# EAGLE board pepino4 (EAGLE 6.3)
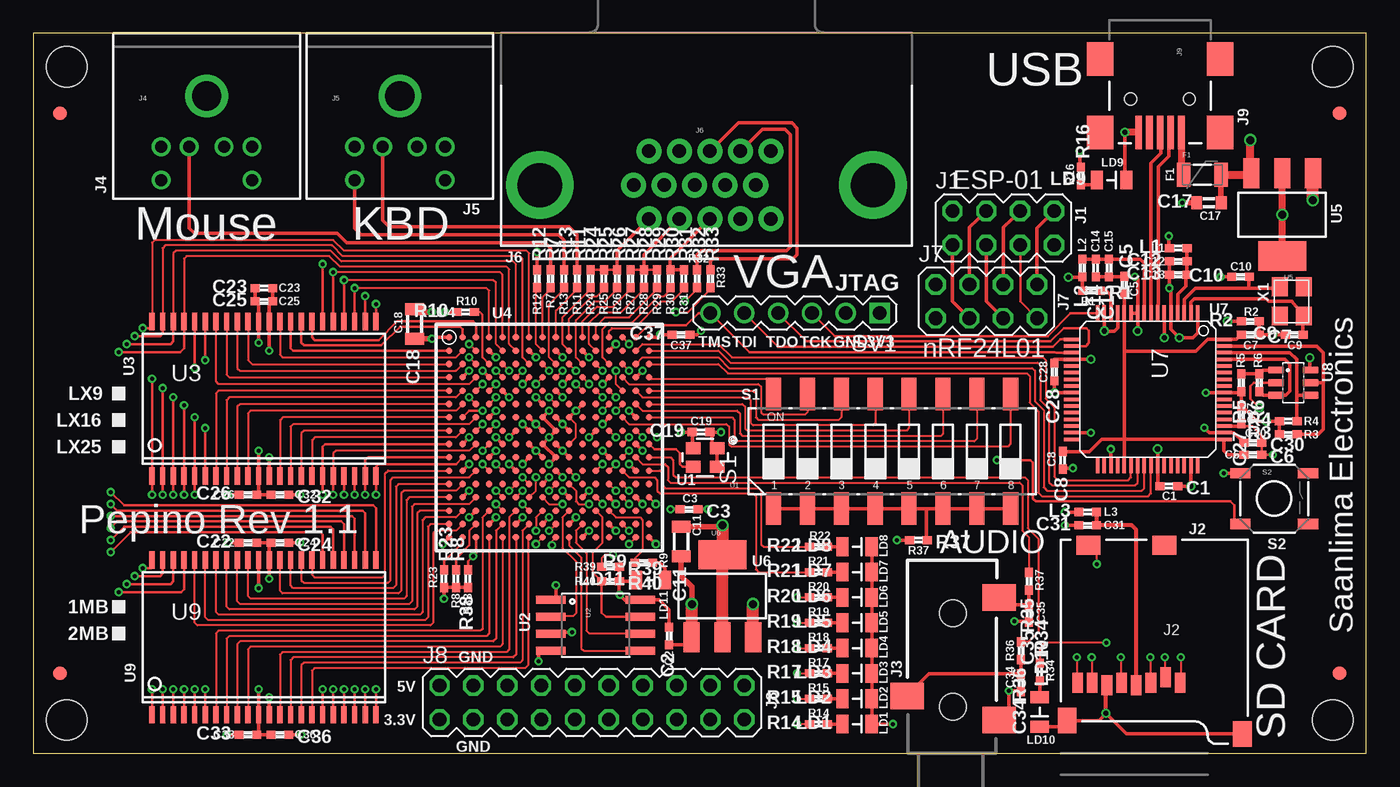
[diagram p4: board, top side]
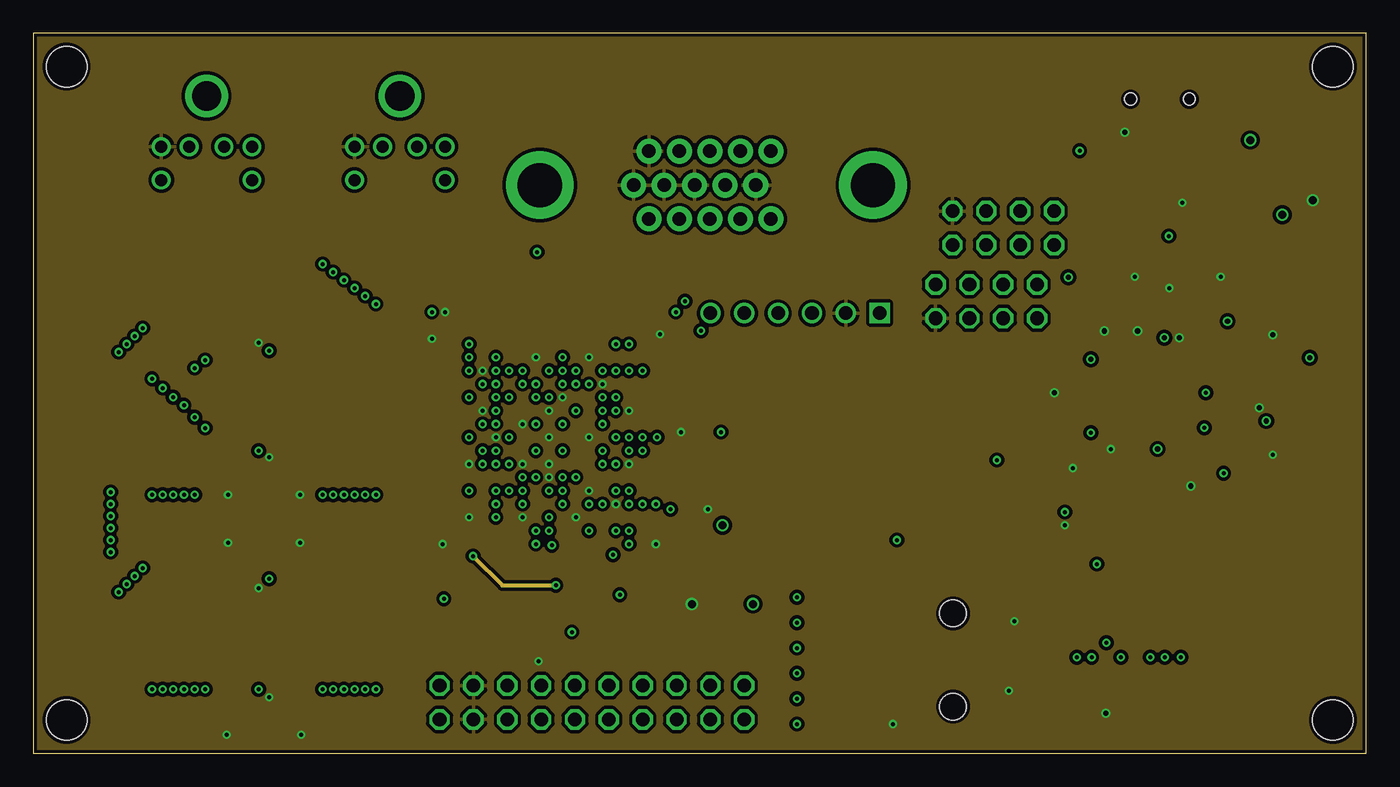
[diagram p5: board, inner layer Route2]
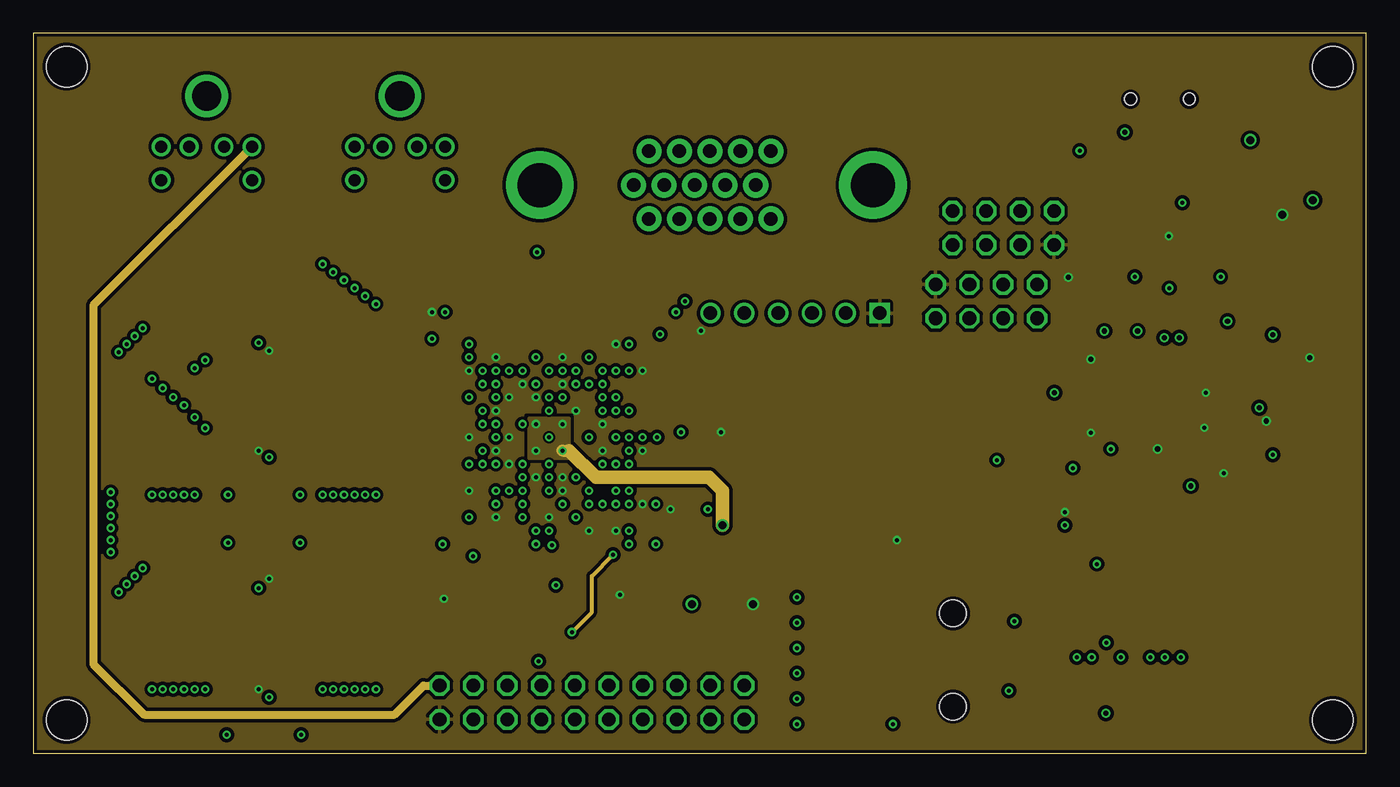
[diagram p6: board, inner layer Route3]
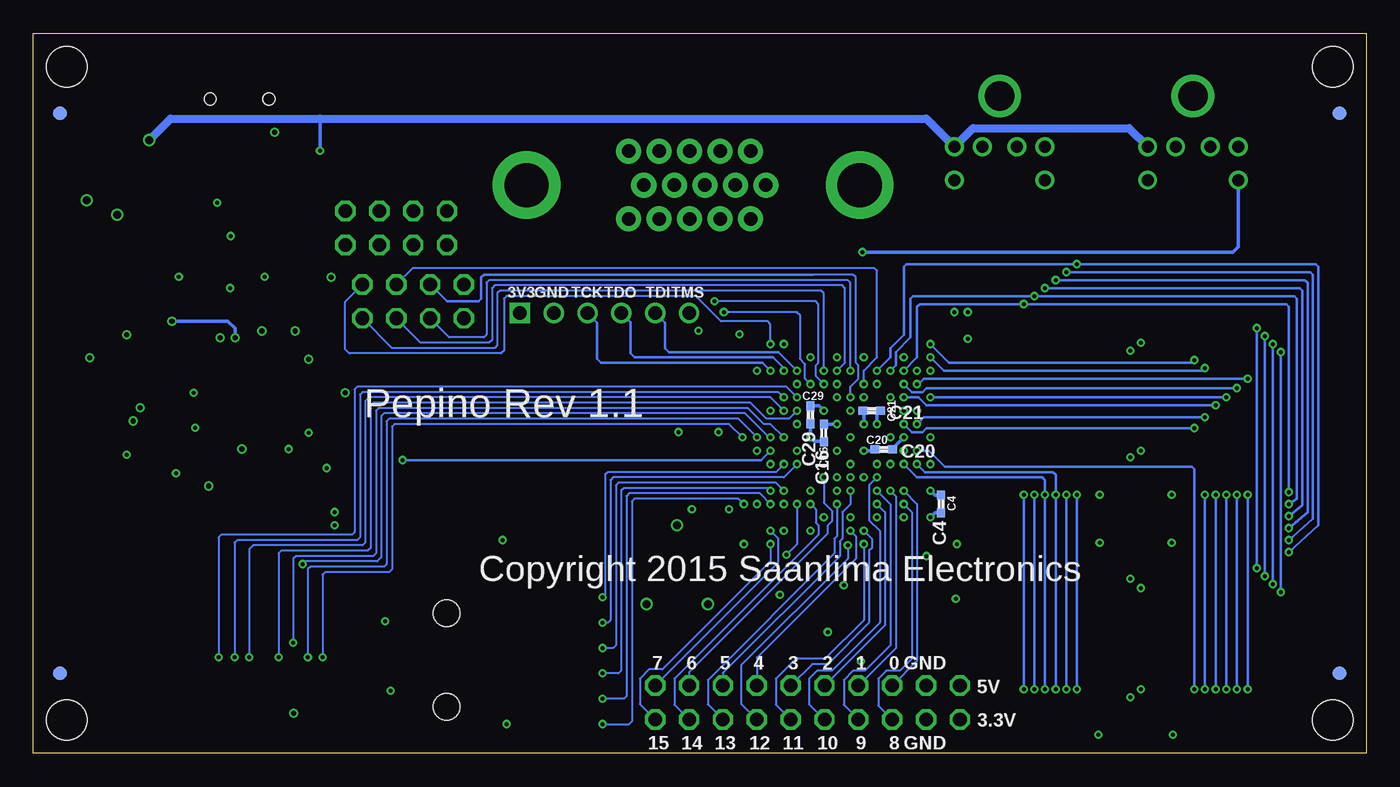
[diagram p7: board, bottom side, seen from below]

Size 100 x 54 mm. Coordinates in mm from the lower left corner, seen from the top.
Outline: 0,0 100,0 100,54 0,54 0,0
Copper layers (1*2+3*16): Top 0.035mm / dielectric 0.2mm / Route2 0.035mm / dielectric 0.05mm / Route3 0.035mm / dielectric 0.2mm / Bottom 0.035mm
Design rules "Fusion_eagle_rule_v1.1 *": minimum track width 6mil, minimum drill 0.3mm, track to track 6mil, track to pad 6mil, pad to pad 6mil, via to via 6mil, smd to smd 0mil, copper to edge 10mil, drill to drill 10mil, minimum pad ring 10mil, minimum via ring 6mil, stop-mask expansion 2mil, vias tented up to drill 12mil, thermal gap 10mil
Net classes: 1 power: width 0.203 mm
Holes 3.05 mm at 2.5,51.5 2.5,2.5 97.5,51.5 97.5,2.5

## Footprints (pad centres in the part's own frame; a part is rotated, then mirrored left to right if it is on the bottom)
0402 = smd 0.7 x 0.6: 1 -0.655,0; 2 0.655,0
0805 = smd 0.9 x 1.4: 1 -1.1,0; 2 1.1,0
0603 = smd 0.8 x 1: 1 -0.925,0; 2 0.925,0
PTC-1206 = smd 1 x 1.8: 1 -1.4,0; 2 1.4,0
MA04-2 = drill 1.016 octagon: 1 -3.81,-1.27; 2 -3.81,1.27; 3 -1.27,-1.27; 4 -1.27,1.27; 5 1.27,-1.27; 6 1.27,1.27; 7 3.81,-1.27; 8 3.81,1.27
MICRO-SD-SOCKET-PP = smd 0.8 x 1.5: 1 -8.94,10.7; 2 -7.84,10.3; 3 -6.74,10.7; 4 -5.64,10.9; 5 -4.54,10.7; 6 -3.44,10.9; 7 -2.34,10.7; 8 -1.24,10.7 | smd 1.8 x 1.4: CD1 -2.05,0.4; CD2 -7.75,0.4 | smd 1.4 x 1.9: GND1 -13.6,14.55; GND3 -0.45,13.55
AUDIO-JACK-3.5MM-3 = smd 2 x 2.5: RING 4.3,3.45; SLEEVE 2.5,-3.45; TIP 11.7,-3.45 | hole 2: 3.5,0; 10.5,0
MINI-DIN6 = drill 0.9: 1 -1.3,-8.5; 2 1.3,-8.5; 3 -3.4,-8.5; 4 3.4,-8.5; 5 -3.4,-11; 6 3.4,-11 | drill 2.2: P$1 0,-4.7
DB15 = drill 1.016 pad 1.88: 1 -4.32,-7.62; 2 -2.03,-7.62; 3 0.26,-7.62; 4 2.55,-7.62; 5 4.84,-7.62; 6 -5.46,-5.08; 7 -3.17,-5.08; 8 -0.88,-5.08; 9 1.41,-5.08; 10 3.7,-5.08; 11 -4.32,-2.54; 12 -2.03,-2.54; 13 0.26,-2.54; 14 2.55,-2.54; 15 4.84,-2.54 | drill 3.302 pad 5.08: G1 -12.5,-5.08; G2 12.5,-5.08
MA10-2 = drill 1.016 octagon: 1 -11.43,-1.27; 2 -11.43,1.27; 3 -8.89,-1.27; 4 -8.89,1.27; 5 -6.35,-1.27; 6 -6.35,1.27; 7 -3.81,-1.27; 8 -3.81,1.27; 9 -1.27,-1.27; 10 -1.27,1.27; 11 1.27,-1.27; 12 1.27,1.27; 13 3.81,-1.27; 14 3.81,1.27; 15 6.35,-1.27; 16 6.35,1.27; 17 8.89,-1.27; 18 8.89,1.27; 19 11.43,-1.27; 20 11.43,1.27
USB-MINIB = smd 2.5 x 0.5: D+ 2.5,0; D- 2.5,0.8; GND 2.5,-1.6; ID 2.5,-0.8; VBUS 2.5,1.6 | smd 2.5 x 2: MTN1 -3,4.5; MTN2 2.5,4.5; MTN3 -3,-4.5; MTN4 2.5,-4.5 | hole 0.9: 0,2.2; 0,-2.2
FIDUCIAL-1X2 = smd 1 x 1: 1 0,0
0805_POL = smd 0.9 x 1.4: + 1.1,0; - -1.1,0
CTS-219-08 = smd 1.13 x 2.44: 1 -8.89,-4.3; 2 -6.35,-4.3; 3 -3.81,-4.3; 4 -1.27,-4.3; 5 1.27,-4.3; 6 3.81,-4.3; 7 6.35,-4.3; 8 8.89,-4.3; 9 8.89,4.3; 10 6.35,4.3; 11 3.81,4.3; 12 1.27,4.3; 13 -1.27,4.3; 14 -3.81,4.3; 15 -6.35,4.3; 16 -8.89,4.3
TACTILE_SWITCH_SMD = smd 1.524 x 0.762: 1 -2.54,1.905; 2 2.54,1.905; 3 -2.54,-1.905; 4 2.54,-1.905
MA06-1 = drill 1.016 square: 1 0,0 | drill 1.016: 2 2.54,0; 3 5.08,0; 4 7.62,0; 5 10.16,0; 6 12.7,0
CRYSTAL-OSC-SMD-2.5X2 = smd 1.1 x 0.9: 1 -0.9,-0.7; 2 0.9,-0.7; 3 0.9,0.7; 4 -0.9,0.7
SO08-EIAJ = smd 0.61 x 2.21: 1 -1.905,-3.378; 2 -0.635,-3.378; 3 0.635,-3.378; 4 1.905,-3.378; 5 1.905,3.353; 6 0.635,3.353; 7 -0.635,3.353; 8 -1.905,3.353
TSOP44-II = smd 0.4 x 1.3: 1 -8.4,-5.8; 2 -7.6,-5.8; 3 -6.8,-5.8; 4 -6,-5.8; 5 -5.2,-5.8; 6 -4.4,-5.8; 7 -3.6,-5.8; 8 -2.8,-5.8; 9 -2,-5.8; 10 -1.2,-5.8; 11 -0.4,-5.8; 12 0.4,-5.8; 13 1.2,-5.8; 14 2,-5.8; 15 2.8,-5.8; 16 3.6,-5.8; 17 4.4,-5.8; 18 5.2,-5.8; 19 6,-5.8; 20 6.8,-5.8; 21 7.6,-5.8; 22 8.4,-5.8; 23 8.4,5.8; 24 7.6,5.8; 25 6.8,5.8; 26 6,5.8; 27 5.2,5.8; 28 4.4,5.8; 29 3.6,5.8; 30 2.8,5.8; 31 2,5.8; 32 1.2,5.8; 33 0.4,5.8; 34 -0.4,5.8; 35 -1.2,5.8; 36 -2,5.8; 37 -2.8,5.8; 38 -3.6,5.8; 39 -4.4,5.8; 40 -5.2,5.8; 41 -6,5.8; 42 -6.8,5.8; 43 -7.6,5.8; 44 -8.4,5.8
FT256 = smd 0.5 x 0.5: A1 -7.5,7.5; A2 -6.5,7.5; A3 -5.5,7.5; A4 -4.5,7.5; A5 -3.5,7.5; A6 -2.5,7.5; A7 -1.5,7.5; A8 -0.5,7.5; A9 0.5,7.5; A10 1.5,7.5; A11 2.5,7.5; A12 3.5,7.5; A13 4.5,7.5; A14 5.5,7.5; A15 6.5,7.5; A16 7.5,7.5; B1 -7.5,6.5; B2 -6.5,6.5; B3 -5.5,6.5; B4 -4.5,6.5; B5 -3.5,6.5; B6 -2.5,6.5; B7 -1.5,6.5; B8 -0.5,6.5; B9 0.5,6.5; B10 1.5,6.5; B11 2.5,6.5; B12 3.5,6.5; B13 4.5,6.5; B14 5.5,6.5; B15 6.5,6.5; B16 7.5,6.5; C1 -7.5,5.5; C2 -6.5,5.5; C3 -5.5,5.5; C4 -4.5,5.5; C5 -3.5,5.5; C6 -2.5,5.5; C7 -1.5,5.5; C8 -0.5,5.5; C9 0.5,5.5; C10 1.5,5.5; C11 2.5,5.5; C12 3.5,5.5; C13 4.5,5.5; C14 5.5,5.5; C15 6.5,5.5; C16 7.5,5.5; D1 -7.5,4.5; D2 -6.5,4.5; D3 -5.5,4.5; D4 -4.5,4.5; D5 -3.5,4.5; D6 -2.5,4.5; D7 -1.5,4.5; D8 -0.5,4.5; D9 0.5,4.5; D10 1.5,4.5; D11 2.5,4.5; D12 3.5,4.5; D13 4.5,4.5; D14 5.5,4.5; D15 6.5,4.5; D16 7.5,4.5; E1 -7.5,3.5; E2 -6.5,3.5; E3 -5.5,3.5; E4 -4.5,3.5; E5 -3.5,3.5; E6 -2.5,3.5; E7 -1.5,3.5; E8 -0.5,3.5; E9 0.5,3.5; E10 1.5,3.5; E11 2.5,3.5; E12 3.5,3.5; E13 4.5,3.5; E14 5.5,3.5; E15 6.5,3.5; E16 7.5,3.5; F1 -7.5,2.5; F2 -6.5,2.5; F3 -5.5,2.5; F4 -4.5,2.5; F5 -3.5,2.5; F6 -2.5,2.5; F7 -1.5,2.5; F8 -0.5,2.5; F9 0.5,2.5; F10 1.5,2.5; F11 2.5,2.5; F12 3.5,2.5; F13 4.5,2.5; F14 5.5,2.5; F15 6.5,2.5; F16 7.5,2.5; G1 -7.5,1.5; G2 -6.5,1.5; G3 -5.5,1.5; G4 -4.5,1.5; G5 -3.5,1.5; G6 -2.5,1.5; G7 -1.5,1.5; G8 -0.5,1.5; G9 0.5,1.5; G10 1.5,1.5; G11 2.5,1.5; G12 3.5,1.5; G13 4.5,1.5; G14 5.5,1.5; G15 6.5,1.5; G16 7.5,1.5; H1 -7.5,0.5; H2 -6.5,0.5; H3 -5.5,0.5; H4 -4.5,0.5; H5 -3.5,0.5; H6 -2.5,0.5; H7 -1.5,0.5; H8 -0.5,0.5; H9 0.5,0.5; H10 1.5,0.5; H11 2.5,0.5; H12 3.5,0.5; H13 4.5,0.5; H14 5.5,0.5; H15 6.5,0.5; H16 7.5,0.5; J1 -7.5,-0.5; J2 -6.5,-0.5; J3 -5.5,-0.5; J4 -4.5,-0.5; J5 -3.5,-0.5; J6 -2.5,-0.5; J7 -1.5,-0.5; J8 -0.5,-0.5; J9 0.5,-0.5; J10 1.5,-0.5; J11 2.5,-0.5; J12 3.5,-0.5; J13 4.5,-0.5; J14 5.5,-0.5; J15 6.5,-0.5; J16 7.5,-0.5; K1 -7.5,-1.5; K2 -6.5,-1.5; K3 -5.5,-1.5; K4 -4.5,-1.5; K5 -3.5,-1.5; K6 -2.5,-1.5; K7 -1.5,-1.5; K8 -0.5,-1.5; K9 0.5,-1.5; K10 1.5,-1.5; K11 2.5,-1.5; K12 3.5,-1.5; K13 4.5,-1.5; K14 5.5,-1.5; K15 6.5,-1.5; K16 7.5,-1.5; L1 -7.5,-2.5; L2 -6.5,-2.5; L3 -5.5,-2.5; L4 -4.5,-2.5; L5 -3.5,-2.5; L6 -2.5,-2.5; L7 -1.5,-2.5; L8 -0.5,-2.5; L9 0.5,-2.5; L10 1.5,-2.5; L11 2.5,-2.5; L12 3.5,-2.5; L13 4.5,-2.5; L14 5.5,-2.5; L15 6.5,-2.5; L16 7.5,-2.5; M1 -7.5,-3.5; M2 -6.5,-3.5; M3 -5.5,-3.5; M4 -4.5,-3.5; M5 -3.5,-3.5; M6 -2.5,-3.5; M7 -1.5,-3.5; M8 -0.5,-3.5; M9 0.5,-3.5; M10 1.5,-3.5; M11 2.5,-3.5; M12 3.5,-3.5; M13 4.5,-3.5; M14 5.5,-3.5; M15 6.5,-3.5; M16 7.5,-3.5; N1 -7.5,-4.5; N2 -6.5,-4.5; N3 -5.5,-4.5; N4 -4.5,-4.5; N5 -3.5,-4.5; N6 -2.5,-4.5; N7 -1.5,-4.5; N8 -0.5,-4.5; N9 0.5,-4.5; N10 1.5,-4.5; N11 2.5,-4.5; N12 3.5,-4.5; N13 4.5,-4.5; N14 5.5,-4.5; N15 6.5,-4.5; N16 7.5,-4.5; P1 -7.5,-5.5; P2 -6.5,-5.5; P3 -5.5,-5.5; P4 -4.5,-5.5; P5 -3.5,-5.5; P6 -2.5,-5.5; P7 -1.5,-5.5; P8 -0.5,-5.5; P9 0.5,-5.5; P10 1.5,-5.5; P11 2.5,-5.5; P12 3.5,-5.5; P13 4.5,-5.5; P14 5.5,-5.5; P15 6.5,-5.5; P16 7.5,-5.5; R1 -7.5,-6.5; R2 -6.5,-6.5; R3 -5.5,-6.5; R4 -4.5,-6.5; R5 -3.5,-6.5; R6 -2.5,-6.5; R7 -1.5,-6.5; R8 -0.5,-6.5; R9 0.5,-6.5; R10 1.5,-6.5; R11 2.5,-6.5; R12 3.5,-6.5; R13 4.5,-6.5; R14 5.5,-6.5; R15 6.5,-6.5; R16 7.5,-6.5; T1 -7.5,-7.5; T2 -6.5,-7.5; T3 -5.5,-7.5; T4 -4.5,-7.5; T5 -3.5,-7.5; T6 -2.5,-7.5; T7 -1.5,-7.5; T8 -0.5,-7.5; T9 0.5,-7.5; T10 1.5,-7.5; T11 2.5,-7.5; T12 3.5,-7.5; T13 4.5,-7.5; T14 5.5,-7.5; T15 6.5,-7.5; T16 7.5,-7.5
SOT223 = smd 1.219 x 2.235: 1 -2.311,-3.099; 2 0,-3.099; 3 2.311,-3.099 | smd 3.6 x 2.2: 4 0,3.099
DP-EAGLELIBRARY_LQFP64 = smd 1.2 x 0.27: 1 -5.7,3.75; 2 -5.7,3.25; 3 -5.7,2.75; 4 -5.7,2.25; 5 -5.7,1.75; 6 -5.7,1.25; 7 -5.7,0.75; 8 -5.7,0.25; 9 -5.7,-0.25; 10 -5.7,-0.75; 11 -5.7,-1.25; 12 -5.7,-1.75; 13 -5.7,-2.25; 14 -5.7,-2.75; 15 -5.7,-3.25; 16 -5.7,-3.75; 33 5.7,-3.75; 34 5.7,-3.25; 35 5.7,-2.75; 36 5.7,-2.25; 37 5.7,-1.75; 38 5.7,-1.25; 39 5.7,-0.75; 40 5.7,-0.25; 41 5.7,0.25; 42 5.7,0.75; 43 5.7,1.25; 44 5.7,1.75; 45 5.7,2.25; 46 5.7,2.75; 47 5.7,3.25; 48 5.7,3.75 | smd 0.27 x 1.2: 17 -3.75,-5.7; 18 -3.25,-5.7; 19 -2.75,-5.7; 20 -2.25,-5.7; 21 -1.75,-5.7; 22 -1.25,-5.7; 23 -0.75,-5.7; 24 -0.25,-5.7; 25 0.25,-5.7; 26 0.75,-5.7; 27 1.25,-5.7; 28 1.75,-5.7; 29 2.25,-5.7; 30 2.75,-5.7; 31 3.25,-5.7; 32 3.75,-5.7; 49 3.75,5.7; 50 3.25,5.7; 51 2.75,5.7; 52 2.25,5.7; 53 1.75,5.7; 54 1.25,5.7; 55 0.75,5.7; 56 0.25,5.7; 57 -0.25,5.7; 58 -0.75,5.7; 59 -1.25,5.7; 60 -1.75,5.7; 61 -2.25,5.7; 62 -2.75,5.7; 63 -3.25,5.7; 64 -3.75,5.7
SOT23-6 = smd 0.55 x 1.2: 1 -0.95,-1.3; 2 0,-1.3; 3 0.95,-1.3; 4 0.95,1.3; 5 0,1.3; 6 -0.95,1.3
CRYSTAL3.2X2.5MM = smd 1.4 x 1.2: 1 -1.1,-0.9; 2 1.1,-0.9; 3 1.1,0.9; 4 -1.1,0.9

## Placement (x,y rotation side)
C1  .1uF  [0402]  85.2,20.05 0 top
C2  .1uF  [0402]  47.7,8.8 270 top
C3  .1uF  [0402]  49.2,18.3 0 top
C4  4.7uF  [0402]  31.9,18.7 270 bottom
C5  4.7uF  [0402]  81.85,35.1 90 top
C6  .1uF  [0402]  91.5,22.4 0 top
C7  .1uF  [0402]  91.3,31.4 0 top
C8  .1uF  [0402]  77.22,21.98 270 top
C9  27pF  [0402]  94.6,31.4 180 top
C10  27pF  [0402]  90.58,35.75 180 top
C11  22uF  [0805]  48.6,15.9 270 top
C12  4.7uF  [0402]  85.9,36.9 180 top
C13  .1uF  [0402]  85.9,35.9 180 top
C14  4.7uF  [0402]  79.7,36.4 270 top
C15  .1uF  [0402]  80.7,36.4 270 top
C16  4.7uF  [0402]  40.7,24.02 270 bottom
C17  4.7uF  [0603]  88.2,41.3 180 top
C18  22uF  [0805]  28.6,32.2 270 top
C19  .1uF  [0402]  50.1,24.1 180 top
C20  .1uF  [0402]  36.2,22.8 0 bottom
C21  .1uF  [0402]  37.1,25.7 0 bottom
C22  4.7uF  [0402]  16.1,15.8 180 top
C23  4.7uF  [0402]  17.3,34.9 180 top
C24  .1uF  [0402]  18.5,15.8 0 top
C25  .1uF  [0402]  17.3,33.9 180 top
C26  4.7uF  [0402]  16.1,19.4 180 top
C27  .1uF  [0402]  90.62,25.4 270 top
C28  .1uF  [0402]  76.6,28.6 270 top
C29  .1uF  [0402]  41.7,25.4 270 bottom
C30  4.7uF  [0402]  91.5,23.3 0 top
C31  4.7uF  [0402]  79.1,17.1 180 top
C32  .1uF  [0402]  18.5,19.4 0 top
C33  4.7uF  [0402]  16.1,1.4 180 top
C34  4700pF  [0402]  74.1,5.3 270 top
C35  4700pF  [0402]  74.7,10.5 270 top
C36  .1uF  [0402]  18.5,1.4 0 top
C37  4.7uF  [0402]  48.6,31.4 180 top
F1  PTCSMD  [PTC-1206]  87.7,43.4 0 top
J1  ESP-01  [MA04-2]  72.77,39.4 0 top
J2  USD-SOCKETNEW  [MICRO-SD-SOCKET-PP]  77.1,16 180 top
J3  AUDIO-JACK3  [AUDIO-JACK-3.5MM-3]  69,0 90 top
J4  MINI-DIN6PTH  [MINI-DIN6]  13,54 0 top
J5  MINI-DIN6PTH  [MINI-DIN6]  27.5,54 0 top
J6  DB15  [DB15]  50.5,47.7 0 top
J7  nRF24L01+  [MA04-2]  71.5,33.9 0 top
J8  [MA10-2]  41.91,3.81 0 top
J9  USBSMD  [USB-MINIB]  84.53,49.06 270 top
JP1  FIDUCIAL1X2  [FIDUCIAL-1X2]  2,6 0 top
JP2  FIDUCIAL1X2  [FIDUCIAL-1X2]  98,48 0 top
JP3  FIDUCIAL1X2  [FIDUCIAL-1X2]  2,6 0 bottom
JP4  FIDUCIAL1X2  [FIDUCIAL-1X2]  98,48 0 bottom
JP5  FIDUCIAL1X2  [FIDUCIAL-1X2]  2,48 0 top
JP6  FIDUCIAL1X2  [FIDUCIAL-1X2]  98,6 0 top
JP7  FIDUCIAL1X2  [FIDUCIAL-1X2]  2,48 0 bottom
JP8  FIDUCIAL1X2  [FIDUCIAL-1X2]  98,6 0 bottom
L1  [0402]  85.9,37.9 180 top
L2  [0402]  78.7,36.4 270 top
L3  [0402]  79.1,18.1 180 top
LD1  [0805_POL]  61.8,2.2 180 top
LD2  [0805_POL]  61.8,4.1 180 top
LD3  [0805_POL]  61.8,6 180 top
LD4  [0805_POL]  61.8,7.9 180 top
LD5  [0805_POL]  61.8,9.8 180 top
LD6  [0805_POL]  61.8,11.7 180 top
LD7  [0805_POL]  61.8,13.6 180 top
LD8  [0805_POL]  61.8,15.5 180 top
LD9  LED GREEN  [0805_POL]  80.9,43 180 top
LD10  LED RED  [0805_POL]  75.5,3.1 90 top
LD11  LED YELLOW  [0805_POL]  46.3,13 180 top
R1  10K  [0402]  79.4,34.7 0 top
R2  12K  [0402]  91.3,32.4 180 top
R3  10K  [0402]  94.15,23.93 180 top
R4  10K  [0402]  94.15,24.93 180 top
R5  10K  [0402]  90.62,27.8 270 top
R6  2.2K  [0402]  91.97,27.8 270 top
R7  270  [0402]  38.8,35.6 90 top
R8  4.7K  [0402]  31.7,13.1 90 top
R9  1K  [0402]  45.8,14.3 180 top
R10  4.7K  [0402]  32.42,33.1 180 top
R11  270  [0402]  40.8,35.6 90 top
R12  270  [0402]  37.8,35.6 90 top
R13  270  [0402]  39.8,35.6 90 top
R14  1K  [0402]  58.9,2.2 180 top
R15  1K  [0402]  58.9,4.1 180 top
R16  1K  [0402]  78.6,43.3 90 top
R17  1K  [0402]  58.9,6 180 top
R18  1K  [0402]  58.9,7.9 180 top
R19  1K  [0402]  58.9,9.8 180 top
R20  1K  [0402]  58.9,11.7 180 top
R21  1K  [0402]  58.9,13.6 180 top
R22  1K  [0402]  58.9,15.5 180 top
R23  4.7K  [0402]  30.8,13.1 90 top
R24  2K  [0402]  41.8,35.6 90 top
R25  1K  [0402]  42.8,35.6 90 top
R26  560  [0402]  43.8,35.6 90 top
R27  2K  [0402]  44.8,35.6 90 top
R28  1K  [0402]  45.8,35.6 90 top
R29  560  [0402]  46.8,35.6 90 top
R30  820  [0402]  47.8,35.6 90 top
R31  390  [0402]  48.8,35.6 90 top
R32  100  [0402]  49.8,35.6 90 top
R33  100  [0402]  50.8,35.6 90 top
R34  1K  [0402]  75.5,6.1 90 top
R35  3.3K  [0402]  74.7,12.9 270 top
R36  3.3K  [0402]  74.1,7.7 270 top
R37  100  [0402]  66.4,16 0 top
R38  4.7K  [0402]  32.6,13.1 270 top
R39  10K  [0402]  43.3,14 0 top
R40  10K  [0402]  43.3,12.9 0 top
S1  219-08  [CTS-219-08]  64.43,22.65 0 top
S2  SWITCH-MOMENTARY-2SMD  [TACTILE_SWITCH_SMD]  93.1,19.1 0 top
SV1  [MA06-1]  63.5,33.02 180 top
U1  OSCILLATOR2.5X2  [CRYSTAL-OSC-SMD-2.5X2]  50.4,22.2 180 top
U2  FLASH-SPI-25XXSMD1  [SO08-EIAJ]  42.2,9.6 270 top
U3  IS61WV25616  [TSOP44-II]  17.3,26.6 0 top
U4  6SLX9FTG256  [FT256]  38.7,23.7 0 top
U5  [SOT223]  93.7,40.4 180 top
U6  [SOT223]  51.7,11.8 0 top
U7  [DP-EAGLELIBRARY_LQFP64]  83.6,27.3 270 top
U8  93C46B  [SOT23-6]  94.53,27.8 270 top
U9  IS61WV25616  [TSOP44-II]  17.3,8.7 0 top
X1  12MHz  [CRYSTAL3.2X2.5MM]  94.4,33.9 90 top

## Tracks (layer width: path | path; a pad name or v marks a point on that pad's centre or on a via)
1V2  (via drill 0.3, 0.6)
  Top 0.254: U4.G7 v37.7,24.7 U4.H8 | U4.G9 v39.7,24.7 U4.H10 | U4.J7 v37.7,22.7 U4.K8 | U4.J9 v39.7,22.7 U4.K10
  Top 0.406: C11.1 51.7,17
  Top 0.914: v51.7,17.1 51.7,17 U6.4 U6.2
  Route3 0.914: v39.7,22.7 40.2,22.7
  Route3 1.016: 40.2,22.7 42.2,20.7 50.7,20.7 51.7,19.7 v51.7,17.1
  Bottom 0.254: C16.1 40.68,24.7 v39.7,24.7 | C20.1 36.95,22.7 v37.7,22.7 | C21.1 37.7,25.64 v37.7,24.7
  pour Route3: 40.17,25.12 37.17,25.12 37.17,22.12 40.17,22.12
1V8
  Top 0.254: C7.1 90.25,31.05 U7.64 88.1,31.05 87.22,30.18 81.85,30.18 | 81.85,30.18 U7.12 C5.1 | 81.85,30.18 81.85,23.55 | 81.85,23.55 U7.37 | 81.85,23.55 U7.49 89.3,22.7 89.6,22.4 C6.1 | C8.1 79.23,22.63 80.15,23.55 81.85,23.55
3V3  (via drill 0.3, 0.38, 0.6)
  Top 0.152: U4.N7 37.7,19.7 v37.7,20.7 | U4.J10 40.7,23.7 40.7,24.7 U4.G10
  Top 0.178: S2.1
  Top 0.254: v79.35,29.55 U7.20 76.6,29.55 C28.1 | v87.97,27.05 U7.56 90.53,27.05 R5.2 C27.1 | v79.35,24.05 U7.31 | v84.35,22.82 U7.42 84.35,20.25 C1.1 | v87.85,24.43 88.22,24.05 U7.50 90.08,24.05 C30.1 | R3.2 R4.2 v92.5,24.93 91.83,24.93 90.83,25.93 90.62,25.93 | v95.78,29.68 95.78,28.82 U8.6 | U1.4 U1.1 50.9,23.2 50.9,23.95 C19.1 v51.6,24.1 | U4.G10 v40.7,25.7 U4.F11 | U4.F8 v37.7,26.7 | U4.H6 v35.7,23.7 | U4.E5 v35.7,26.7 | U4.D7 v36.7,27.7 | U4.D2 v32.7,28.7 | U4.B4 v34.7,29.7 | U4.B13 v43.7,30.7 | U4.D10 v39.7,27.7 | U4.B9 v39.7,29.7 | U4.D15 v45.7,28.7 | U4.G4 v34.7,25.7 | U4.J2 v32.7,23.7 | U4.K4 v34.7,22.7 | v17.7,30.2 U3.33 17.7,33.65 C25.1 C23.1 | v16.9,22.7 U3.11 16.9,19.4 | U4.R4 v34.7,17.7 | U4.N2 v32.7,19.7 | U4.L6 v35.7,21.7 | v30.8,11.6 R23.1 R8.1 R38.2 | v17.7,13.1 U9.33 17.7,15.65 C24.1 C22.1 | v16.9,4.8 U9.11 16.9,1.4 | v77.65,35.7 78.66,35.7 L2.2 78.7,34.74 R1.1 | U4.R8 v38.7,17.7 | U4.T11 v41.7,16.7 | U4.R13 v43.7,16.7 | U4.N15 v45.7,18.7 | U4.N10 v39.7,19.7 | U4.L9 v39.7,20.7 | U4.G13 v42.7,24.7 | U4.K13 v42.7,22.7 | U4.J15 v45.7,22.7 | L3.2 v77.4,18.1 | L1.2 85.2,37.95 v85.2,38.8 | 16.9,19.4 C26.1 | C32.1 16.9,19.4 | C33.1 16.9,1.4 | C36.1 16.9,1.4 | S2.1 v89.3,21 | R37.1 v64.8,16 | R39.2 R40.2 | R40.2 43.95,11.95 v44,11.9 44.4,11.5 U2.8 46.95,11.51 47.7,10.76 C2.1 | LD11.+ 45.1,12.9 R40.2 | C3.1 v47.8,18.3 | C37.1 49.8,31.4 v50.1,31.7
  Top 0.406: C18.1 28.8,33.1 v29.9,33.1
  Top 0.508: U5.4 v93.7,40.4 U5.2
  Top 0.914: U6.3 54.01,11.19 v54,11.2
  Bottom 0.254: C4.1 32.35,19.36 v32.7,19.7 | C29.1 41.05,26.05 v40.7,25.7
  pour Route3 (isolate 0.254, rank 2): 0,0 0,54 100,54 100,0
5V  (via drill 0.3, 0.6)
  Top 0.254: R16.2 78.5,44.05 v78.5,45.2
  Top 0.406: U5.3 91.3,43.99 | F1.2 89.1,41.33 C17.1
  Top 0.508: 91.33,43.99 U5.3
  Top 0.61: 91.3,43.99 v91.3,46 | F1.2 91.29,43.4 U5.3
  Route3 0.61: J8.2 29.28,5.08 27.1,2.9 8.3,2.9 4.5,6.7 4.5,33.6 J4.4
  Bottom 0.254: v78.5,45.2 78.5,47.6
  Bottom 0.61: v91.3,46 89.7,47.6 78.5,47.6 33,47.6 J5.4 29.5,46.9 17.8,46.9 J4.4
A0  (via drill 0.3)
  Top 0.178: v8.9,19.4 U3.1 v8.9,28.1 | v8.9,4.8 U9.1 | U4.E3 v33.7,27.7
  Bottom 0.178: v8.9,19.4 v8.9,4.8 | v33.7,27.7 33.6,27.7 33.2,28.1 v8.9,28.1
A1  (via drill 0.3)
  Top 0.178: v9.7,19.4 U3.2 v9.7,27.4 | v9.7,4.8 U9.2 | U4.E4 v34.7,27.7
  Bottom 0.178: v9.7,19.4 v9.7,4.8 | v34.7,27.7 34.1,27.1 33.3,27.1 33,27.4 v9.7,27.4
A2  (via drill 0.3)
  Top 0.178: v10.5,19.4 U3.3 v10.5,26.7 | v10.5,4.8 U9.3 | U4.F3 v32.7,26.7
  Bottom 0.178: v10.5,19.4 v10.5,4.8 | v32.7,26.7 v10.5,26.7
A3  (via drill 0.3)
  Top 0.178: v11.3,19.4 U3.4 v11.3,26.1 | v11.3,4.8 U9.4 | U4.F4 v34.7,26.7
  Bottom 0.178: v11.3,19.4 v11.3,4.8 | v34.7,26.7 33.6,26.7 33,26.1 v11.3,26.1
A4  (via drill 0.3)
  Top 0.178: v12.1,19.4 U3.5 v12.1,25.2 | U9.5 v12.1,4.8 | U4.H3 v33.7,24.7
  Bottom 0.178: v12.1,19.4 v12.1,4.8 | v33.7,24.7 33.2,25.2 v12.1,25.2
A5  (via drill 0.3)
  Top 0.152: U4.J3 32.7,22.7 22.7,22.7 22.5,22.5 U3.18
  Top 0.178: U3.18 v22.5,19.4 | U9.18 v22.5,4.8
  Bottom 0.178: v22.5,19.4 v22.5,4.8
A6  (via drill 0.3)
  Top 0.178: U3.19 v23.3,19.4 | U9.19 v23.3,4.8 | U4.L4 v33.7,21.7
  Bottom 0.178: v23.3,4.8 v23.3,19.4 23.3,20.9 23.5,21.1 33.1,21.1 v33.7,21.7
A7  (via drill 0.3)
  Top 0.178: U3.20 v24.1,19.4 | U9.20 v24.1,4.8 | U4.L5 v34.7,21.7
  Bottom 0.178: v24.1,4.8 v24.1,19.4 24.1,20.5 24.3,20.7 33.7,20.7 v34.7,21.7
A8  (via drill 0.3)
  Top 0.178: v24.9,19.4 U3.21 24.9,22 25.1,22.2 U4.K1 | U9.21 v24.9,4.8
  Bottom 0.178: v24.9,19.4 v24.9,4.8
A9  (via drill 0.3)
  Top 0.178: v25.7,19.4 U3.22 25.7,21.5 25.9,21.7 31.7,21.7 U4.K2 | U9.22 v25.7,4.8
  Bottom 0.178: v25.7,19.4 v25.7,4.8
A10  (via drill 0.3)
  Top 0.178: U3.23 v25.7,33.7 | v5.8,19.6 6.8,18.6 25.5,18.6 25.7,18.4 U9.23 | U4.D5 v34.7,28.7
  Bottom 0.178: v5.8,19.6 5.8,33.5 6,33.7 v25.7,33.7 33.5,33.7 33.7,33.5 33.7,29.7 v34.7,28.7
A11  (via drill 0.3)
  Top 0.178: U3.24 v24.9,34.3 | v5.8,18.7 6.3,18.2 24.7,18.2 24.9,18 U9.24 | U4.C5 v35.7,28.7
  Bottom 0.178: v5.8,18.7 5.2,19.1 5.2,34.1 5.4,34.3 v24.9,34.3 34,34.3 34.2,34.1 34.2,31.2 35.3,30.1 35.3,29.1 v35.7,28.7
A12  (via drill 0.3)
  Top 0.152: U4.A4 34.2,34.7 34,34.9 v24.1,34.9
  Top 0.178: U3.25 v24.1,34.9 | v5.8,17.8 23.9,17.8 24.1,17.6 U9.25
  Bottom 0.178: v24.1,34.9 5,34.9 4.8,34.7 4.8,18.6 v5.8,17.8
A13  (via drill 0.3)
  Top 0.152: U4.B5 34.7,30.7 34.7,35.3 34.5,35.5 v23.3,35.5
  Top 0.178: U3.26 v23.3,35.5 | v5.8,16.9 6.3,17.4 23.1,17.4 23.3,17.2 U9.26
  Bottom 0.178: v23.3,35.5 4.6,35.5 4.4,35.3 4.4,18.1 v5.8,16.9
A14  (via drill 0.3)
  Top 0.152: U4.A5 35.2,35.9 35,36.1 v22.5,36.1
  Top 0.178: U9.27 22.5,16.8 22.3,17 6.8,17 v5.8,16 | v22.5,36.1 U3.27
  Bottom 0.178: v5.8,16 4,17.6 4,35.9 4.2,36.1 v22.5,36.1
A15  (via drill 0.3)
  Top 0.152: U4.A6 36.2,36.7 36,36.9 23.1,36.9 22.3,37.7 10.7,37.7 10.5,37.5 10.5,32.5 10.6,32.4 U3.42
  Top 0.178: U3.42 10.5,30.9 10.3,30.7 v7,30.7 | v7,12.7 10.3,12.7 10.5,12.9 U9.42
  Bottom 0.178: v7,30.7 v7,12.7
A16  (via drill 0.3)
  Top 0.152: U4.C7 36.7,29.7 36.7,37.1 36.5,37.3 23.2,37.3 22.4,38.1 9.9,38.1 9.7,37.9 U3.43
  Top 0.178: U3.43 9.7,31.5 9.5,31.3 v7.6,31.3 | v7.6,13.3 9.5,13.3 9.7,13.5 U9.43
  Bottom 0.178: v7.6,31.3 v7.6,13.3
A17  (via drill 0.3)
  Top 0.152: U4.A7 37.2,37.5 37,37.7 23.3,37.7 22.5,38.5 9.1,38.5 8.9,38.3 U3.44
  Top 0.178: U3.44 8.9,31.9 v8.2,31.9 | v8.2,13.9 8.8,13.9 8.9,14 U9.44
  Bottom 0.178: v8.2,31.9 v8.2,13.9
A18  (via drill 0.3)
  Top 0.178: U3.28 v21.7,36.7 | v5.8,15.1 7.3,16.6 21.5,16.6 21.7,16.4 U9.28 | U4.D6 v36.7,28.7
  Bottom 0.178: v5.8,15.1 3.6,17.1 3.6,36.5 3.8,36.7 v21.7,36.7 34.5,36.7 34.7,36.5 34.7,31.4 35.7,30.4 35.7,29.7 v36.7,28.7
AUDIO1
  Top 0.152: U4.K15 45.7,21.7 47.4,21.7 47.6,21.5 47.6,20.5 47.8,20.3 74,20.3 74.2,20.1 74.2,16.7 74.7,16.2 R35.1
AUDIO2
  Top 0.152: U4.K16 47.8,22.2 48,22 48,20.9 48.2,20.7 74.4,20.7 74.6,20.5 74.6,16.9 75.4,16.1 75.4,9.1 74.66,8.36 R36.1
BE0  (via drill 0.3)
  Top 0.178: U4.B3 v32.7,30.7 | v12.9,29.5 U3.39
  Bottom 0.178: v32.7,30.7 31.3,29.3 13.1,29.3 v12.9,29.5
BE1  (via drill 0.3)
  Top 0.178: U4.C3 v32.7,29.7 | v12.1,28.9 U3.40
  Bottom 0.178: v32.7,29.7 31.7,28.7 12.3,28.7 v12.1,28.9
BE2
  Top 0.152: U4.R1 29.8,17.2 29.6,17 29.6,10.2 29.4,10 13.1,10 12.9,10.2 U9.39
BE3
  Top 0.152: U4.R2 31.7,16.7 30.2,16.7 30,16.5 30,9.8 29.8,9.6 12.3,9.6 12.1,9.8 U9.40
BLUE
  Top 0.254: R31.2 R30.2 47.76,36.3 47.76,37.08 J6.3
BLUE0
  Top 0.152: U4.C13 42.7,29.7 42.7,31.8 43.2,32.3 44.9,32.3 46.9,34.3 47.3,34.3 47.8,34.8 R30.1
BLUE1
  Top 0.152: R31.1 48.8,34.8 47.9,33.9 47.1,33.9 45.1,31.9 43.4,31.9 43.2,31.7 U4.A13
BUTTON  (via drill 0.3)
  Top 0.178: U4.K14 v44.7,22.7 | v72.3,22 74.8,22 75,21.8 75,19.1 75.2,18.9 89.8,18.9 90.1,18.6 90.1,17.2 S2.3
  Bottom 0.178: v44.7,22.7 45.4,22 v72.3,22
CLK  (via drill 0.3)
  Top 0.152: U4.F13 v42.7,25.7 | v81.6,7.2 81.6,5.34 J2.5
  Bottom 0.152: v42.7,25.7 43.3,25.1 45,25.1 46.2,26.3 74.5,26.3 74.7,26.1 74.7,15.4 74.9,15.2 81.4,15.2 81.6,15 v81.6,7.2
CMD  (via drill 0.3)
  Top 0.152: U4.F14 v43.7,25.7 | v83.8,7.2 83.8,5.34 J2.3
  Bottom 0.152: v43.7,25.7 44.7,26.7 74.8,26.7 75.1,26.4 75.1,15.8 75.3,15.6 83.5,15.6 83.8,15.3 v83.8,7.2
CS0  (via drill 0.3)
  Top 0.178: U4.H4 v34.7,24.7 | v12.9,24.4 U3.6
  Bottom 0.178: v34.7,24.7 34.1,24.1 33.3,24.1 33,24.4 v12.9,24.4
CS1  (via drill 0.3)
  Top 0.178: v12.9,4.8 U9.6 | U4.J4 v33.7,22.7
  Bottom 0.178: v12.9,4.8 12.9,21.3 13.1,21.5 31.6,21.5 32.8,22.7 v33.7,22.7
CTS
  Top 0.152: U4.C16 51.4,29.2 52.1,28.5 74.55,28.5 74.75,28.3 74.75,26.3 75.4,25.65 75.4,19.55 75.65,19.3 83.65,19.3 83.85,19.5 U7.41
D0
  Top 0.152: U4.E1 13.9,27.2 13.7,27 U3.7
D1
  Top 0.152: U4.E2 31.7,26.7 14.7,26.7 14.5,26.5 U3.8
D2
  Top 0.152: U4.F1 15.5,26.2 15.3,26 U3.9
D3
  Top 0.152: U4.F2 31.7,25.7 16.3,25.7 16.1,25.5 U3.10
D4
  Top 0.152: U4.G1 18.7,25.2 18.5,25 U3.13
D5
  Top 0.152: U4.G3 32.7,24.7 19.5,24.7 19.3,24.5 U3.14
D6
  Top 0.152: U4.H1 20.3,24.2 20.1,24 U3.15
D7
  Top 0.152: U4.H2 31.7,23.7 21.1,23.7 20.9,23.5 U3.16
D8
  Top 0.178: U3.29 20.9,31.2 21.1,31 25.9,31 27.3,32.4 33,32.4 33.2,32.2 U4.A3
D9
  Top 0.178: U3.30 20.1,30.8 20.3,30.6 26.1,30.6 27.5,32 32,32 32.2,31.8 U4.A2
D10
  Top 0.178: U3.31 19.3,30.4 19.5,30.2 U4.B1
D11
  Top 0.152: U3.32 18.5,29.9 18.7,29.7 31.7,29.7 U4.B2
D12
  Top 0.152: U3.35 16.1,29.5 16.4,29.2 U4.C1
D13
  Top 0.152: U3.36 15.3,28.9 15.5,28.7 31.7,28.7 U4.C2
D14
  Top 0.152: U3.37 14.5,28.4 14.7,28.2 U4.D1
D15
  Top 0.152: U4.D3 32.7,27.7 13.9,27.7 13.7,27.9 U3.38
D16
  Top 0.152: U4.P4 33.7,17.7 33.7,9.3 33.5,9.2 13.9,9.2 13.7,9 U9.7
D17
  Top 0.152: U4.T4 34.2,9 34,8.8 14.7,8.8 14.5,8.6 U9.8
D18
  Top 0.152: U4.R5 34.7,16.7 34.7,8.6 34.5,8.4 15.5,8.4 15.3,8.2 U9.9
D19
  Top 0.152: U4.T5 35.2,8.2 35,8 16.3,8 16.1,7.8 U9.10
D20
  Top 0.152: U4.P6 35.7,17.7 35.7,7.8 35.5,7.6 18.7,7.6 18.5,7.4 U9.13
D21
  Top 0.152: U4.T6 36.2,7.4 36,7.2 19.5,7.2 19.3,7 U9.14
D22
  Top 0.152: U4.R7 36.7,16.7 36.7,7 36.5,6.8 20.3,6.8 20.1,6.6 U9.15
D23
  Top 0.152: U4.T7 37.1,16.1 37.1,6.6 36.9,6.4 21.1,6.4 20.9,6.2 U9.16
D24
  Top 0.152: U9.29 20.9,13.4 21.1,13.2 26.2,13.2 26.4,13.4 26.4,21 26.6,21.2 U4.L1
D25
  Top 0.152: U9.30 20.1,13 20.3,12.8 26.6,12.8 26.8,13 26.8,20.5 27,20.7 32.7,20.7 U4.L3
D26
  Top 0.152: U4.M1 27.4,20.2 27.2,20 27.2,12.6 27,12.4 19.5,12.4 19.3,12.6 U9.31
D27
  Top 0.152: U4.M2 31.7,19.7 27.8,19.7 27.6,19.5 27.6,12.2 27.4,12 18.7,12 18.5,12.2 U9.32
D28
  Top 0.152: U4.N1 28.2,19.2 28,19 28,11.8 27.8,11.6 16.3,11.6 16.1,11.8 U9.35
D29
  Top 0.152: U4.N3 32.7,18.7 28.6,18.7 28.4,18.5 28.4,11.4 28.2,11.2 15.5,11.2 15.3,11.4 U9.36
D30
  Top 0.152: U4.P1 29,18.2 28.8,18 28.8,11 28.6,10.8 14.7,10.8 14.5,11 U9.37
D31
  Top 0.152: U4.P2 31.7,17.7 29.4,17.7 29.2,17.5 29.2,10.6 29,10.4 13.9,10.4 13.7,10.6 U9.38
DAT0  (via drill 0.3)
  Top 0.152: U4.H15 v45.7,23.7 | v79.4,7.2 79.4,5.34 J2.7
  Bottom 0.152: v45.7,23.7 47.1,25.1 73.3,25.1 73.5,24.9 73.5,14.2 73.7,14 79.2,14 79.4,13.8 v79.4,7.2
DAT1  (via drill 0.3)
  Top 0.152: U4.H16 v46.8,23.7 | v78.3,7.2 78.3,5.34 J2.8
  Bottom 0.152: v46.8,23.7 47.8,24.7 72.9,24.7 73.1,24.5 73.1,13.8 73.3,13.6 78.1,13.6 78.3,13.4 v78.3,7.2
DAT2  (via drill 0.3)
  Top 0.152: U4.E12 v42.7,26.7 | v86.1,7.2 86.1,5.37 J2.1
  Bottom 0.152: v42.7,26.7 43.5,27.5 75.7,27.5 75.9,27.3 75.9,16.6 76.1,16.4 85.9,16.4 86.1,16.2 v86.1,7.2
DAT3  (via drill 0.3)
  Top 0.152: U4.E13 v43.7,26.7 | v84.9,7.2 84.9,5.75 J2.2
  Bottom 0.152: v43.7,26.7 44.1,27.1 75.3,27.1 75.5,26.9 75.5,16.2 75.7,16 84.7,16 84.9,15.8 v84.9,7.2
DONE
  Top 0.152: U4.P13 43.7,17.7 45.5,17.7 45.7,17.5 45.7,15.2 45.15,14.64 R9.2
EECLK
  Top 0.254: U7.62 94.28,30.05 94.78,29.55 94.78,26.8 | 94.78,26.8 94.78,25.07 R4.1 | U8.4 94.83,26.85 94.78,26.8
EECS
  Top 0.254: U7.63 96.28,30.55 96.78,30.05 96.78,27.8 | 96.78,27.8 U8.5 | R3.1 96.4,23.93 96.78,24.3 96.78,27.8
EEDATA
  Top 0.254: U7.61 93.9,29.55 94.28,29.18 94.28,27.18 93.95,26.85 U8.3 92.28,26.85 R6.2
FLASH_CS  (via drill 0.3)
  Top 0.178: U4.T3 33.2,15 v33,14.8 32.6,14.4 R38.1 | 38.8,11.7 U2.1
  Top 0.254: v39.2,12.6 39.2,11.71 U2.1
  Route2 0.305: v33,14.8 35.2,12.6 v39.2,12.6
FLASH_MISO0
  Top 0.152: U4.T10 40.2,15.6 41.1,14.7 41.1,7.9 41.3,7.7 U2.5
FLASH_MISO1
  Top 0.152: U4.P10 39.7,17.7 39.7,15.4 40.7,14.4 40.7,10.5 40.5,10.3 38.89,10.3 U2.2
FLASH_MISO2  (via drill 0.3)
  Top 0.152: U4.N12 v42.7,18.7 | v43.5,14.9 42.9,14.9 42.65,14.64 R39.1
  Top 0.254: U2.3 38.96,9.1 v40.4,9.1
  Route3 0.305: v40.4,9.1 41.9,10.6 41.9,13.3 v43.5,14.9
  Bottom 0.152: v42.7,18.7 42.7,15.7 v43.5,14.9
FLASH_MISO3
  Top 0.152: R40.1 42,13.54 42,15.1 42.7,15.8 42.7,17.7 U4.P12
  Top 0.178: U2.7 42.97,10.23 42.65,10.55 R40.1
FLASH_SCK
  Top 0.152: U4.R11 40.7,16.7 40.7,15.8 41.5,15 41.5,9.2 41.7,9 45.52,9 U2.6
GND  (via drill 0.3, 0.38, 0.6)
  Top 0.178: U4.G2 32.7,25.7 v33.7,25.7
  Top 0.203: U8.2 91.55,27.8 91.3,27.55 91.3,26.6 v91.97,25.93 | v93,22.4 C6.2 C30.2 92.13,23.87 91.45,24.55 90.53,24.55
  Top 0.254: U7.25 v76.6,27.05 C28.2 | U7.51 90.53,24.55 C27.2 | v38.7,25.7 U4.G8 U4.H9 v38.7,23.7 U4.J8 U4.K9 v38.7,21.7 | U4.K7 v36.7,21.7 | U4.H7 v36.7,24.7 | U4.H12 v41.7,23.7 | U4.J5 v34.7,23.7 | U4.L2 v32.7,21.7 | U4.P3 v32.7,17.7 | U4.R6 v36.7,17.7 | U4.D4 v33.7,28.7 | U7.47 v86.85,20.05 C1.2 | U7.15 v80.35,31.68 81.1,31.68 81.35,31.93 U7.13 | U7.10 v82.85,31.68 | U7.10 U7.11 | U7.10 82.85,35.55 v82.65,35.75 v82.65,35.76 C5.2 C15.2 C14.2 | C12.2 C13.2 85.22,35.84 v85.22,34.9 85.35,34.77 U7.5 85.35,31.8 v85.97,31.18 86.97,31.18 87.35,31.55 U7.1 | U7.35 v80.85,22.82 | C9.2 v93,31.4 C7.2 R2.1 | C10.2 v89.08,35.75 | U4.E9 v39.7,26.7 | U4.B11 v41.7,29.7 | U4.D13 v42.7,27.7 | U4.B7 v37.7,29.7 | U4.A16 46.8,31.2 v47.02,31.43 47.05,31.4 C37.2 | U1.2 49.45,23.14 C19.2 v48.6,24.1 | U4.A1 30,31.2 v29.9,31.1 | v16.9,30.8 U3.34 16.9,33.65 C25.2 C23.2 | U3.12 v17.7,22.2 | U4.T1 v30.7,15.7 | U9.34 v16.9,12.4 | U9.12 v17.7,4.2 | R10.2 v30.9,33.1 | U4.M8 v38.7,20.7 | U4.L15 v44.7,21.7 | U4.N13 v43.7,18.7 | LD8.- LD7.- LD6.- LD5.- LD4.- LD3.- LD2.- LD1.- v64.5,2.2 | C8.2 77.31,21.4 v78,21.4 | U4.R10 v40.7,17.7 | U4.N11 v41.7,19.7 | U4.G15 v44.7,25.7 | U4.T16 v46.7,15.7 | J2.GND3 77.6,2.46 | 77.6,2.46 79.93,2.46 v80.47,3 82.02,1.46 J2.GND1 | LD10.- 77.14,2 77.6,2.46 | C31.2 v77.4,17.1 | C35.2 74.64,9.9 v73.6,9.9 | C34.2 74.05,4.7 v73.2,4.7 73.2,3.25 J3.SLEEVE | LD9.- 81.9,43.1 v81.9,46.58 | C26.2 v14.6,19.4 | C32.2 v20,19.4 | C24.2 v20,15.8 | C22.2 v14.6,15.8 | C36.2 v20.1,1.4 | C33.2 v14.5,1.4 | U2.4 37.9,7.89 v37.9,6.9 | C3.2 v50.6,18.3 | C2.2 48.83,8.14 U6.1
  Top 0.305: v80.47,3 80.47,5.04 J2.6
  Top 0.406: C18.2 v29.9,31.1 | C11.2 48.6,13.3 49.4,12.5 v49.4,11.2 | C17.2 v86.2,41.3
  Top 0.508: J9.GND 81.91,46.56 v81.9,46.58
  Top 0.914: v96,41.48 96,43.89 U5.1 | U6.1 49.4,8.71 v49.4,11.2
  Bottom 0.254: C16.2 40.73,23.4 41.4,23.4 v41.7,23.7 C29.2 | C20.2 35.55,22.86 v34.7,23.7 | C21.2 36.7,25.45 v36.7,24.7 | C4.2 32.35,18.05 v32.7,17.7
  pour Route2 (isolate 0.254): 0,0 0,54 100,54 100,0
GREEN
  Top 0.178: R27.2 R28.2 45.8,36.3 45.84,36.26 R29.2
  Top 0.254: 45.8,36.3 45.8,37.41 J6.2
GREEN0
  Top 0.152: U4.A11 41.2,32.4 42.3,33.5 43.5,33.5 44.8,34.8 R27.1
GREEN1
  Top 0.152: U4.B12 41.7,30.7 41.7,32.3 42.5,33.1 44.1,33.1 45.8,34.8 R28.1
GREEN2
  Top 0.152: U4.A12 42.2,32 42.9,32.7 44.7,32.7 46.8,34.8 R29.1
HS
  Top 0.254: R33.2 50.8,36.9 51,37.1 57,37.1 57.3,37.4 57.3,46.9 56.9,47.3 52.9,47.3 J6.13
HSYNC  (via drill 0.3)
  Top 0.152: U4.D11 v41.7,27.7 | v48.2,33.1 49.1,33.1 50.8,34.8 R33.1
  Bottom 0.152: v48.2,33.1 42.7,33.1 42.5,32.9 42.5,29.6 42.1,29.2 42.1,28.1 v41.7,27.7
INIT_B
  Top 0.152: U4.R3 32.7,16.7 32.7,15.6
  Top 0.178: 32.7,15.6 31.7,14.6 R8.2
IO1N  (via drill 0.3)
  Top 0.152: U4.P5 v34.7,18.7
  Bottom 0.152: v34.7,18.7 34.1,18.1 34.1,7.1 35,6.2 36,6.2 36.6,5.6 36.6,3.58 J8.5
IO1P  (via drill 0.3)
  Top 0.152: U4.N5 v34.7,19.7
  Bottom 0.152: v34.7,19.7 33.7,18.7 33.7,6.94 J8.6
IO2N  (via drill 0.3)
  Top 0.152: U4.N6 v36.7,19.7
  Bottom 0.152: v36.7,19.7 35.7,18.7 35.7,8.1 37.6,6.2 38.5,6.2 39.2,5.5 39.2,3.64 J8.7
IO2P  (via drill 0.3)
  Top 0.152: U4.M6 v35.7,19.7
  Bottom 0.152: v35.7,19.7 35.3,19.3 35.3,7.88 J8.8
IO3N  (via drill 0.3)
  Top 0.152: U4.M7 v36.7,20.7
  Bottom 0.152: v36.7,20.7 37.3,20.1 37.3,17.5 36.5,16.7 36.5,9.8 40.1,6.2 41.2,6.2 41.8,5.6 41.8,3.7 J8.9
IO3P  (via drill 0.3)
  Top 0.152: U4.P7 v36.7,18.7
  Bottom 0.152: v36.7,18.7 36.1,18.1 36.1,9.62 J8.10
IO4N  (via drill 0.3)
  Top 0.152: U4.T8 v37.7,15.7
  Bottom 0.152: v37.7,15.7 37.7,10 40.6,7.1 42.8,7.1 44.3,5.6 44.3,3.66 J8.11
IO4P  (via drill 0.3)
  Top 0.152: U4.P8 37.7,17.7 v37.7,16.7
  Bottom 0.152: v37.7,16.7 37.1,16.1 37.1,15.4 37.3,15.2 37.3,9.8 40.4,6.7 41.56,6.7 J8.12
IO5N  (via drill 0.3)
  Top 0.152: U4.T9 38.9,15.9 v38.9,15.6
  Bottom 0.152: v38.9,15.6 38.9,14.6 46.9,6.6 46.9,3.72 J8.13
IO5P  (via drill 0.3)
  Top 0.152: U4.R9 v38.7,16.7
  Bottom 0.152: v38.7,16.7 38.3,16.3 38.3,14.6 45.72,7.18 J8.14
IO6N  (via drill 0.3)
  Top 0.152: U4.N8 38.7,18.7 v39.7,18.7
  Bottom 0.152: v39.7,18.7 39.7,16.3 39.9,16.1 39.9,15 49.4,5.5 49.4,3.68 J8.15
IO6P  (via drill 0.3)
  Top 0.152: U4.M9 v38.7,19.7
  Bottom 0.152: v38.7,19.7 38.7,18.7 39.3,18.1 39.3,16.1 39.5,15.9 39.5,14.8 48.26,6.04 J8.16
IO7N  (via drill 0.3)
  Top 0.152: U4.M10 40.7,19.7 40.7,18.9 40.9,18.7 v41.7,18.7
  Bottom 0.152: v41.7,18.7 41.3,18.3 41.3,17.3 41.1,17.1 41.1,16.4 51.9,5.6 51.9,3.64 J8.17
IO7P  (via drill 0.3)
  Top 0.152: U4.L10 v40.7,20.7
  Bottom 0.152: v40.7,20.7 40.7,18.8 40.1,18.2 40.1,17.4 40.4,17.1 40.4,16.5 50.8,6.1 J8.18
IO8N  (via drill 0.3)
  Top 0.152: U4.T15 v44.7,15.7
  Bottom 0.152: v44.7,15.7 44.7,14.4 52.8,6.3 53.8,6.3 54.5,5.6 54.5,3.7 J8.19
IO8P  (via drill 0.3)
  Top 0.152: v44.7,16.7 U4.R14
  Bottom 0.152: J8.20 44.1,14.32 44.1,16.1 v44.7,16.7
IRQ  (via drill 0.3)
  Top 0.152: U4.A14 v44.7,30.7
  Top 0.254: J7.8 75.31,39.4 J1.8
  Bottom 0.152: J7.8 76.6,33.88 76.6,30.3 76.3,30 64.9,30 64.7,30.2 64.7,34.1 64.5,34.3 50.3,34.3 48.4,32.4 44.9,32.4 44.7,32.2 v44.7,30.7
LED1  (via drill 0.3)
  Top 0.152: U4.N16 v46.7,18.7 | R14.2 v57.3,2.2
  Bottom 0.152: v46.7,18.7 47.1,19.1 54.9,19.1 55.1,18.9 55.1,2.4 55.3,2.2 v57.3,2.2
LED2  (via drill 0.3)
  Top 0.152: U4.N14 v44.7,18.7 | v57.3,4.1 R15.2
  Bottom 0.152: v44.7,18.7 45.5,19.5 55.3,19.5 55.5,19.3 55.5,4.3 55.7,4.1 v57.3,4.1
LED3  (via drill 0.3)
  Top 0.152: U4.M14 v44.7,19.7 | v57.3,6 R17.2
  Bottom 0.152: v44.7,19.7 44.9,19.9 55.7,19.9 55.9,19.7 55.9,6.2 56.1,6 v57.3,6
LED4  (via drill 0.3)
  Top 0.152: U4.M13 v43.7,19.7 | v57.3,7.9 R18.2
  Bottom 0.152: v43.7,19.7 44.3,20.3 56.1,20.3 56.3,20.1 56.3,8.1 56.5,7.9 v57.3,7.9
LED5  (via drill 0.3)
  Top 0.152: U4.L12 v42.7,21.7 | v57.3,9.8 R19.2
  Bottom 0.152: v42.7,21.7 43.7,20.7 56.5,20.7 56.7,20.5 56.7,10 56.9,9.8 v57.3,9.8
LED6  (via drill 0.3)
  Top 0.152: U4.L13 v43.7,21.7 | v57.3,11.7 R20.2
  Bottom 0.152: v43.7,21.7 44.3,21.1 56.9,21.1 57.1,20.9 57.1,11.9 v57.3,11.7
LED7
  Top 0.152: U4.L14 44.7,20.7 46.6,20.7 46.8,20.5 46.8,19.7 47,19.5 54,19.5 54.2,19.3 54.2,13.8 54.4,13.6 R21.2
LED8
  Top 0.152: U4.L16 47,21.2 47.2,21 47.2,20.1 47.4,19.9 54.4,19.9 54.6,19.7 54.6,15.7 54.8,15.5 R22.2
MISO  (via drill 0.3)
  Top 0.152: U4.C10 v40.7,28.7
  Top 0.178: J7.7 74.04,33.9 J1.5
  Bottom 0.152: v40.7,28.7 40.7,34.5 40.9,34.7 65,34.7 65.2,34.5 65.2,30.6 65.4,30.4 73.08,30.4 J7.7
MOSI  (via drill 0.3)
  Top 0.152: U4.D8 v37.7,27.7
  Top 0.254: J1.6 72.77,39.47 J7.6
  Bottom 0.152: v37.7,27.7 37.7,28.7 36.7,29.7 36.7,36.2 36.9,36.4 71.54,36.4 J7.6
N$1
  Top 0.254: R7.2 38.8,37.9 38.4,38.3 23.5,38.3 22.8,39 12.1,39 11.7,39.4 J4.1
N$2
  Top 0.254: R9.1 47,14.3 47.4,13.9 LD11.-
N$3
  Top 0.152: U4.C4 33.7,29.7 33.7,32.9 33.5,33.1 R10.1
N$4
  Top 0.254: R11.2 40.8,38.9 40.2,39.5 26.7,39.5 26.2,40 J5.1
N$6  (via drill 0.3)
  Top 0.254: R12.2 v37.8,37.6
  Bottom 0.254: v37.8,37.6 10,37.6 9.6,38 J4.5
N$7
  Top 0.305: L3.1 C31.1 82.4,17.1 82.74,16.76 J2.4
N$8
  Top 0.254: R13.2 39.8,38.5 39.4,38.9 24.6,38.9 24.1,39.4 J5.5
N$9
  Top 0.254: U7.2 86.85,33.85 87.1,34.1 92.5,34.1 92.7,33.9 94.4,33.9 X1.1 95.25,32.95 C9.1
N$10
  Top 0.254: U7.3 86.35,34.05 87.17,34.88 91.2,34.88 | 93.45,35.25 X1.3 93.12,34.88 91.2,34.88 | C10.1 91.2,35.48 91.2,34.88
N$11
  Top 0.254: LD9.+ 79.44,42.65 R16.1
N$12
  Top 0.254: LD1.+ R14.1
N$13
  Top 0.254: U7.7 84.35,33.65 84.4,33.7 84.4,44 85.2,44.8 85.2,46.44 J9.D-
N$14
  Top 0.254: U7.8 83.85,44.25 84.6,45 84.6,46.49 J9.D+
N$15
  Top 0.254: LD7.+ R21.1
N$18
  Top 0.254: U7.9 83.35,36.75 83.05,37.05 C15.1 C14.1 L2.1
N$19
  Top 0.254: U7.14 80.85,34.35 80.5,34.7 R1.2
N$20  (via drill 0.38)
  Top 0.254: U7.6 v84.85,31.18 | R2.2 v89.6,32.4
  Bottom 0.254: v84.85,31.18 84.85,31.88 85.4,32.4 v89.6,32.4
N$21
  Top 0.254: U7.4 85.85,34.42 86.47,35.05 86.47,35.85 C13.1 C12.1 L1.1
N$22
  Top 0.254: LD2.+ R15.1
N$23
  Top 0.254: LD3.+ R17.1
N$24
  Top 0.254: LD4.+ R18.1
N$25
  Top 0.254: LD5.+ R19.1
N$26
  Top 0.254: LD6.+ R20.1
N$27
  Top 0.254: U8.1 92.28,28.75 R6.1 R5.1
N$28
  Top 0.254: LD8.+ R22.1
N$29
  Top 0.254: R34.1 LD10.+
N$30
  Top 0.254: J3.RING 67.2,5.96 C34.1 R36.2
N$31
  Top 0.254: J3.TIP 73,11.15 C35.1 R35.2
NE  (via drill 0.3)
  Top 0.152: U4.C8 v38.7,28.7
  Top 0.254: J1.1 68.96,33.9 J7.3
  Bottom 0.152: v38.7,28.7 38.7,35.3 38.9,35.5 65.8,35.5 66,35.3 66,31.4 66.2,31.2 68.8,31.2 J7.3
OE  (via drill 0.3)
  Top 0.152: U4.B6 35.7,30.7 35.7,36.3 35.5,36.5 23,36.5 22.2,37.3 11.5,37.3 11.3,37.1 11.3,32.5 11.2,32.4 U3.41
  Top 0.178: U3.41 11.3,30.4 11,30.1 v6.4,30.1 | v6.4,12.1 11.1,12.1 11.3,12.3 11.3,14.3 11.2,14.4 U9.41
  Bottom 0.178: v6.4,30.1 v6.4,12.1
OSC_IN
  Top 0.178: U1.3 48.7,21.5 48.5,21.7 48.5,22.5 48.2,22.8 46.6,22.8 U4.J16
PMOD2-IO1
  Top 0.152: U4.A8 38.2,34.2 38.8,34.8 R7.1
PMOD2-IO2
  Top 0.152: U4.A9 39.2,33.2 40.8,34.8 R11.1
PMOD2-IO3
  Top 0.152: U4.B8 37.7,30.7 37.7,34.84 R12.1
PMOD2-IO4
  Top 0.152: U4.C9 38.7,29.7 38.7,33.7 39.8,34.8 R13.1
PROGRAM_B
  Top 0.178: U4.T2 32.2,15.8 30.8,14.4 R23.2
PU
  Top 0.254: 55.5,18.39 S1.1 S1.2 S1.3 S1.4 S1.5 67,18.35 | S1.8 S1.7 | S1.7 70.8,18.33 | 67,18.35 S1.6 S1.7 | 67,18.35 67,16.05 R37.2
RED
  Top 0.178: R26.2 R25.2 R24.2
  Top 0.254: R26.2 43.8,37.7 J6.1
RED0
  Top 0.152: U4.B10 39.7,30.7 39.7,32.7 41.8,34.8 R24.1
RED1
  Top 0.152: U4.A10 40.2,32.6 41.9,34.3 42.3,34.3 42.8,34.8 R25.1
RED2
  Top 0.152: U4.C11 40.7,29.7 40.7,32.5 42.1,33.9 42.9,33.9 43.8,34.8 R26.1
RTS
  Top 0.152: U4.C15 45.7,29.7 51.4,29.7 52.2,28.9 74.95,28.9 75.15,28.7 75.15,26.4 75.8,25.75 75.8,19.95 76.05,19.7 83.15,19.7 83.35,19.9 U7.40
RXD
  Top 0.152: U4.B15 45.7,30.7 51.4,30.7 52.4,29.7 75.75,29.7 75.95,29.5 75.95,26.6 76.6,25.95 76.6,20.75 76.85,20.5 82.15,20.5 82.35,20.7 U7.38
SCK  (via drill 0.3)
  Top 0.152: U4.D9 v39.7,28.7
  Top 0.254: J7.5 71.5,33.9 J1.3
  Bottom 0.152: v39.7,28.7 39.1,29.3 39.1,34.9 39.3,35.1 65.4,35.1 65.6,34.9 65.6,31 65.8,30.8 70.94,30.8 J7.5
SD-DET  (via drill 0.3)
  Top 0.152: v79.8,14.2 79.8,14.96 J2.CD1
  Top 0.178: U4.J14 v44.7,23.7
  Bottom 0.152: v44.7,23.7 44.8,23.7 46.6,25.5 73.7,25.5 73.9,25.3 73.9,14.7 74.2,14.4 79.6,14.4 v79.8,14.2
SD-LED  (via drill 0.3)
  Top 0.152: U4.H13 v43.7,23.7 | v80.5,8.3 75.9,8.3 75.5,7.9 R34.2
  Bottom 0.152: v43.7,23.7 44.7,24.7 45.2,24.7 46.4,25.9 74.1,25.9 74.3,25.7 74.3,15 74.5,14.8 80.3,14.8 80.5,14.6 v80.5,8.3
SS  (via drill 0.3)
  Top 0.152: U4.F9 v38.7,26.7
  Top 0.254: J7.4 70.23,39.47 J1.4
  Bottom 0.152: v38.7,26.7 38.7,27.5 38.1,28.1 38.1,29.1 38.3,29.3 38.3,35.7 38.5,35.9 41.5,35.9
  Bottom 0.178: 41.5,35.9 66.2,35.9 66.4,35.7 66.4,34.1 66.6,33.9 68.96,33.9 J7.4
SW1
  Top 0.152: U4.G14 44.7,24.7 52,24.7 52.2,24.5 52.2,23.2 52.4,23 73.1,23 73.32,23.22 S1.9
SW2
  Top 0.152: U4.G16 52.4,25.2 52.6,25 52.6,23.6 52.8,23.4 70.6,23.4 70.78,23.58 S1.10
SW3
  Top 0.152: U4.F15 45.7,25.7 52.8,25.7 53,25.5 53,24 53.2,23.8 68.1,23.8 68.24,23.94 S1.11
SW4
  Top 0.152: U4.F16 53.2,26.2 53.4,26 53.4,24.4 53.6,24.2 65.5,24.2 65.7,24.4 S1.12
SW5
  Top 0.152: U4.E15 45.7,26.7 53.6,26.7 53.8,26.5 53.8,24.8 54,24.6 63,24.6 63.16,24.76 S1.13
SW6
  Top 0.152: U4.E16 54,27.2 54.2,27 54.2,25.2 54.4,25 60.4,25 60.62,25.22 S1.14
SW7
  Top 0.152: U4.D14 44.7,27.7 54.4,27.7 54.6,27.5 54.6,25.6 54.8,25.4 57.9,25.4 58.08,25.58 S1.15
SW8
  Top 0.152: U4.D16 46.3,28.1 55.3,28.1 55.5,27.9 55.5,26.99 S1.16
TCK  (via drill 0.3)
  Top 0.152: U4.C14 v44.7,28.7
  Top 0.178: U7.16 77.8,33 76.1,31.3 60.14,31.3 SV1.3
  Bottom 0.178: v44.7,28.7 45.3,29.3 57.4,29.3 57.7,29.6 57.7,32.3 SV1.3
TDI  (via drill 0.3)
  Top 0.152: U4.C12 v42.7,28.7
  Top 0.178: U7.17 77.05,31.05 76.5,30.5 55.86,30.5 SV1.5
  Bottom 0.178: v42.7,28.7 44.1,30.1 52.3,30.1 52.6,30.4 52.6,32.28 SV1.5
TDO  (via drill 0.3)
  Top 0.152: U4.E14 43.7,27.7 v43.7,28.7
  Top 0.178: U7.18 78.95,30.55 79.2,30.8 79.2,31.7 79,31.9 77.3,31.9 76.3,30.9 58,30.9 SV1.4
  Bottom 0.178: v43.7,28.7 43.7,28.9 44.5,29.7 54.9,29.7 55.2,30 55.2,32.34 SV1.4
TMS
  Top 0.178: U7.19 76.75,30.05 76.6,30.1 53.72,30.1 SV1.6 49.9,33.02 48.98,32.1 46.1,32.1 U4.A15
TXD
  Top 0.152: U4.B16 51.4,30.2 52.3,29.3 75.35,29.3 75.55,29.1 75.55,26.5 76.2,25.85 76.2,20.35 76.45,20.1 82.65,20.1 82.85,20.3 U7.39
VBUS
  Top 0.508: J9.VBUS 86.12,43.58 F1.1
VS
  Top 0.254: R32.2 49.8,37.4 50.1,37.7 56.5,37.7 56.8,38 56.8,46.4 56.4,46.8 54.69,46.8 J6.14
VSYNC  (via drill 0.3)
  Top 0.152: U4.E11 v40.7,27.7 | v48.9,33.9 49.8,34.8 R32.1
  Bottom 0.152: v48.9,33.9 41.3,33.9 41.1,33.7 41.1,29.3 41.3,29.1 41.3,28.3 v40.7,27.7
WE  (via drill 0.3)
  Top 0.178: v21.7,19.4 U3.17 21.7,23 21.9,23.2 U4.J1 | v21.7,4.8 U9.17
  Bottom 0.178: v21.7,19.4 v21.7,4.8

## Text on the board
tPlace: USB | J9 | LD9 | R16 | F1 | J4 | ESP-01 | J5 | J1 | U5 | C17 | Mouse | KBD | J6 | L2 | C14 | C15 | L1 | R32 | C12 | R33 | C13 | C10 | C23 | VGA | JTAG | C5 | X1 | C25 | R10 | R12 | R7 | R13 | R11 | R24 | R25 | R26 | R27 | R28 | R29 | R30 | R31 | J7 | R1 | U4 | U7 | R2 | C18 | C37 | C7 | C9 | TMS | TDI | TDO | TCK | GND | 3V3 | nRF24L01 | R5 | R6 | U3 | C28 | LX9 | S1 | C27 | C19 | R4 | LX16 | C30 | R3 | C6 | LX25 | C8 | U1 | C26 | C1 | C32 | C3 | L3 | C31 | Pepino Rev 1.1 | C22 | C24 | C11 | R22 | LD8 | J2 | S2 | R37 | AUDIO | R23 | R39 | R9 | U6 | R21 | LD7 | R37 | R40 | LD6 | R8 | R38 | LD11 | R20 | LD5 | C35 | 1MB | R19 | U2 | LD4 | Saanlima Electronics | 2MB | C2 | R18 | GND | LD3 | R36 | R34 | R17 | J3 | U9 | 5V | J8 | R15 | LD2 | C34 | 3.3V | R14 | LD1 | C33 | C36 | GND | LD10 | SD CARD
bPlace: TMS | TDI | TDO | TCK | GND | 3V3 | C29 | C21 | Pepino Rev 1.1 | C20 | C16 | C4 | Copyright 2015 Saanlima Electronics | GND | 0 | 1 | 2 | 3 | 4 | 5 | 6 | 7 | 5V | 3.3V | GND | 8 | 9 | 10 | 11 | 12 | 13 | 14 | 15